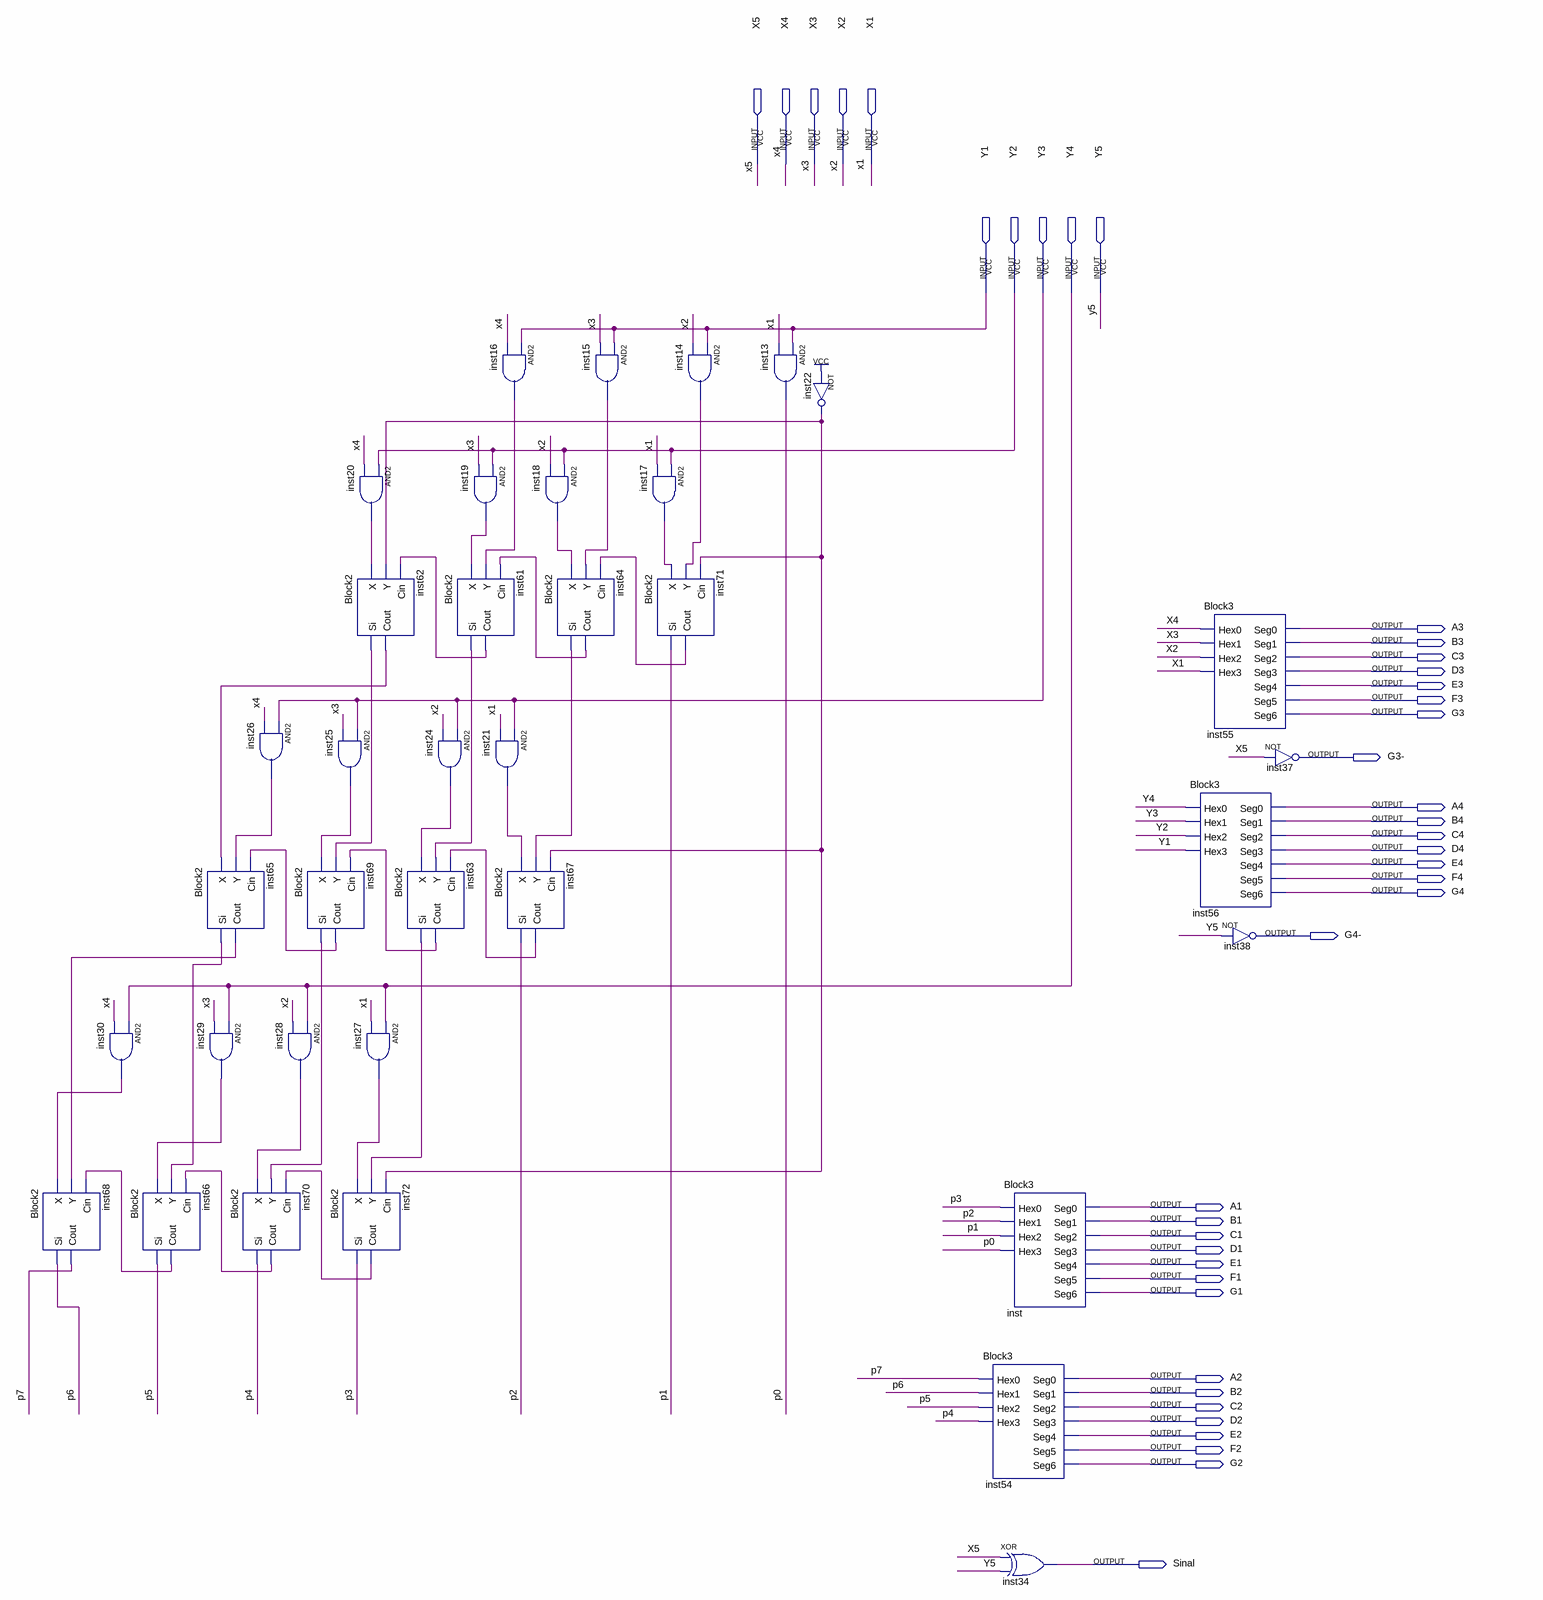
[diagram p0: schematic sheet]
// Quartus schematic aula10.bdf as structural Verilog: 36 symbols, 41 pins
module aula10 (
  input  X5,
  input  X4,
  input  X3,
  input  X2,
  input  X1,
  input  Y1,
  input  Y2,
  input  Y3,
  input  Y4,
  input  Y5,
  output A3,
  output B3,
  output C3,
  output D3,
  output E3,
  output F3,
  output G3,
  output \G3- ,
  output A4,
  output B4,
  output C4,
  output D4,
  output E4,
  output F4,
  output G4,
  output \G4- ,
  output A1,
  output B1,
  output C1,
  output D1,
  output E1,
  output F1,
  output G1,
  output A2,
  output B2,
  output C2,
  output D2,
  output E2,
  output F2,
  output G2,
  output Sinal
);

  wire inst14_out, inst15_out, inst16_out, inst17_out, inst18_out, inst19_out, inst20_out, inst21_out,
       inst22_out, inst24_out, inst25_out, inst26_out, inst27_out, inst28_out, inst29_out, inst30_out,
       inst61_cout, inst61_si, inst62_cout, inst62_si, inst63_cout, inst63_si, inst64_cout, inst64_si,
       inst65_cout, inst65_si, inst66_cout, inst67_cout, inst69_cout, inst69_si, inst70_cout, inst71_cout,
       inst72_cout, p0, p1, p2, p3, p4, p5, p6, p7;

  Block2 inst68 (.X(inst30_out), .Y(inst65_cout), .Cin(inst66_cout), .Si(p6), .Cout(p7));
  and inst30 (inst30_out, Y4, X4);
  Block2 inst66 (.X(inst29_out), .Y(inst65_si), .Cin(inst70_cout), .Si(p5), .Cout(inst66_cout));
  Block2 inst65 (.X(inst62_cout), .Y(inst26_out), .Cin(inst69_cout), .Si(inst65_si), .Cout(inst65_cout));
  and inst29 (inst29_out, Y4, X3);
  Block2 inst70 (.X(inst28_out), .Y(inst69_si), .Cin(inst72_cout), .Si(p4), .Cout(inst70_cout));
  and inst26 (inst26_out, Y3, X4);
  and inst28 (inst28_out, Y4, X2);
  Block2 inst62 (.X(inst20_out), .Y(inst22_out), .Cin(inst61_cout), .Si(inst62_si), .Cout(inst62_cout));
  and inst25 (inst25_out, Y3, X3);
  Block2 inst69 (.X(inst25_out), .Y(inst62_si), .Cin(inst63_cout), .Si(inst69_si), .Cout(inst69_cout));
  Block2 inst72 (.X(inst27_out), .Y(inst63_si), .Cin(inst22_out), .Si(p3), .Cout(inst72_cout));
  and inst20 (inst20_out, Y2, X4);
  Block2 inst63 (.X(inst24_out), .Y(inst61_si), .Cin(inst67_cout), .Si(inst63_si), .Cout(inst63_cout));
  and inst27 (inst27_out, Y4, X1);
  Block2 inst61 (.X(inst19_out), .Y(inst16_out), .Cin(inst64_cout), .Si(inst61_si), .Cout(inst61_cout));
  and inst24 (inst24_out, Y3, X2);
  and inst16 (inst16_out, Y1, X4);
  and inst19 (inst19_out, Y2, X3);
  and inst21 (inst21_out, Y3, X1);
  Block2 inst67 (.X(inst21_out), .Y(inst64_si), .Cin(inst22_out), .Si(p2), .Cout(inst67_cout));
  and inst18 (inst18_out, Y2, X2);
  Block2 inst64 (.X(inst18_out), .Y(inst15_out), .Cin(inst71_cout), .Si(inst64_si), .Cout(inst64_cout));
  and inst15 (inst15_out, Y1, X3);
  and inst14 (inst14_out, Y1, X2);
  and inst17 (inst17_out, Y2, X1);
  Block2 inst71 (.X(inst17_out), .Y(inst14_out), .Cin(inst22_out), .Si(p1), .Cout(inst71_cout));
  and inst13 (p0, Y1, X1);
  not inst22 (inst22_out, 1'b1);
  Block3 inst (
    .Hex0(p3), .Hex1(p2), .Hex2(p1), .Hex3(p0), .Seg0(A1), .Seg1(B1), .Seg2(C1), .Seg3(D1), .Seg4(E1),
    .Seg5(F1), .Seg6(G1));
  Block3 inst54 (
    .Hex0(p7), .Hex1(p6), .Hex2(p5), .Hex3(p4), .Seg0(A2), .Seg1(B2), .Seg2(C2), .Seg3(D2), .Seg4(E2),
    .Seg5(F2), .Seg6(G2));
  xor inst34 (Sinal, X5, Y5);
  Block3 inst55 (
    .Hex0(X4), .Hex1(X3), .Hex2(X2), .Hex3(X1), .Seg0(A3), .Seg1(B3), .Seg2(C3), .Seg3(D3), .Seg4(E3),
    .Seg5(F3), .Seg6(G3));
  Block3 inst56 (
    .Hex0(Y4), .Hex1(Y3), .Hex2(Y2), .Hex3(Y1), .Seg0(A4), .Seg1(B4), .Seg2(C4), .Seg3(D4), .Seg4(E4),
    .Seg5(F4), .Seg6(G4));
  not inst38 (\G4- , Y5);
  not inst37 (\G3- , X5);
endmodule
